# EAGLE design flip_mask (EAGLE 7.7.0)
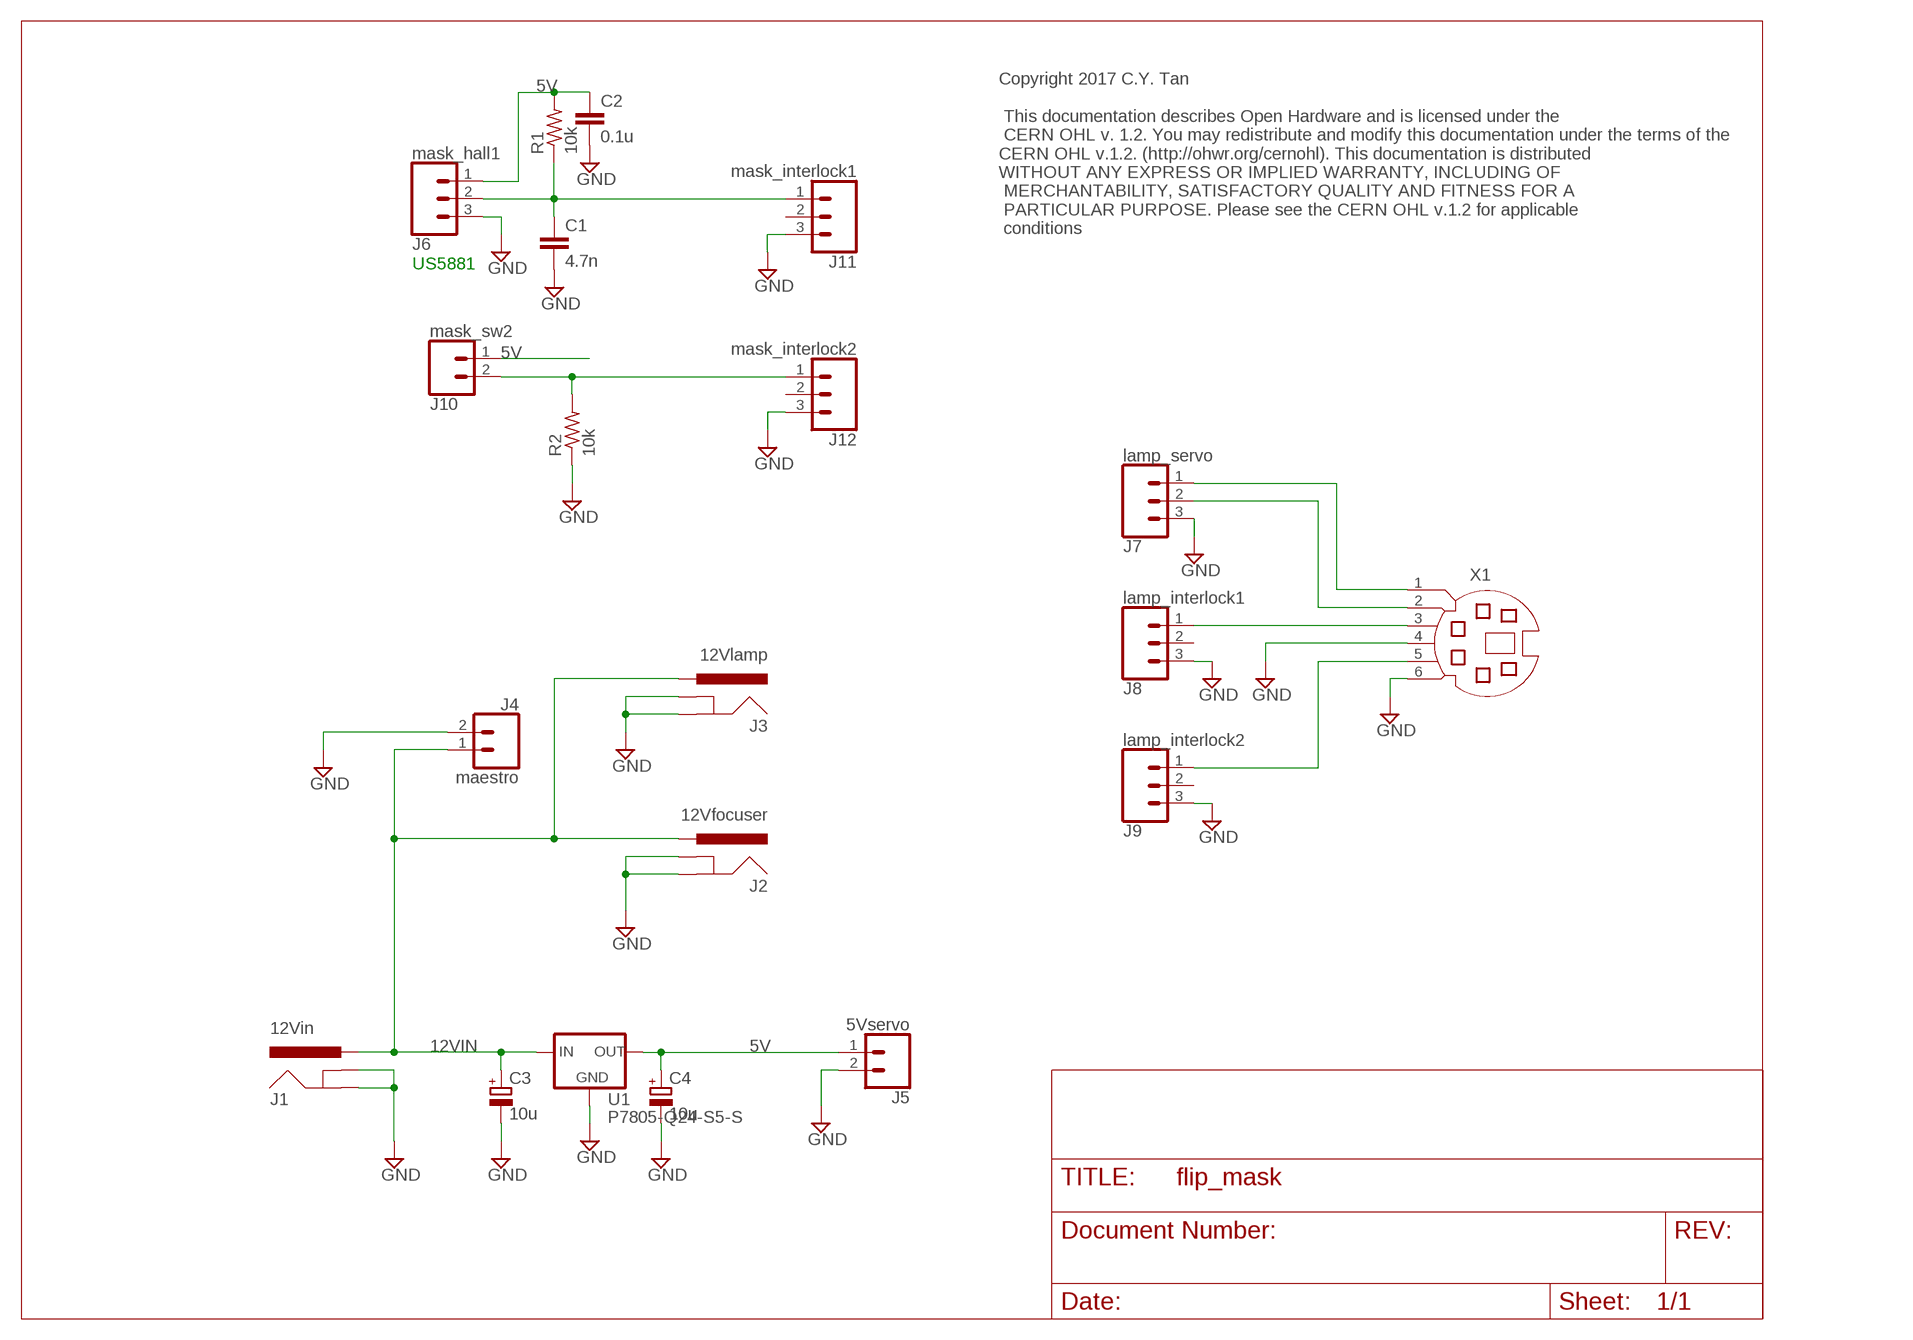
[diagram p0: schematic, sheet 1]

## Parts
C1  4.7n  CAPPTH1  [CAP-PTH-5MM]
C2  0.1u  CAPPTH1  [CAP-PTH-5MM]
C3  10u  CPOL-EUE2.5-6  [E2,5-6]
C4  10u  CPOL-EUE2.5-6  [E2,5-6]
J1  12Vin  POWER_JACK  [POWER_JACK_PTH]
J2  12Vfocuser  POWER_JACK  [POWER_JACK_PTH]
J3  12Vlamp  POWER_JACK  [POWER_JACK_PTH]
J4  maestro  CONN_02  [1X02]
J5  5Vservo  CONN_02  [1X02]
J6  mask_hall1  CONN_03  [1X03]
J7  lamp_servo  CONN_03  [1X03]
J8  lamp_interlock1  CONN_03  [1X03]
J9  lamp_interlock2  CONN_03  [1X03]
J10  mask_sw2  CONN_02  [1X02]
J11  mask_interlock1  CONN_03  [1X03]
J12  mask_interlock2  CONN_03  [1X03]
R1  10k  R-US_0207/10  [0207/10]
R2  10k  R-US_0207/10  [0207/10]
U1  P7805-Q24-S5-S  R-78E5.0-1.0  [DC-DC_CONVERTER_78XX]
X1  MD06SS  [MDIN06SS]

## Nets
5V: C2.1 C4.+ J5.1 J6.1 J10.1 R1.2 U1.VOUT(OUT)
12VIN: C3.+ J1.PWR J2.PWR J3.PWR J4.1 U1.VIN(IN)
GND: C1.2 C2.2 C3.- C4.- J1.GND J1.GNDBREAK J2.GND J2.GNDBREAK J3.GND J3.GNDBREAK J4.2 J5.2 J6.3 J7.3 J8.3 J9.3 J11.3 J12.3 R2.1 U1.GND X1.4 X1.6
N$1: C1.1 J6.2 J11.1 R1.1
N$2: J7.2 X1.2
N$3: J8.1 X1.3
N$4: J10.2 J12.1 R2.2
N$5: J7.1 X1.1
N$6: J9.1 X1.5
Unconnected: J8.2 J9.2 J11.2 J12.2

## Notes on the sheet
- Copyright 2017 C.Y. Tan
  
   This documentation describes Open Hardware and is licensed under the
   CERN OHL v. 1.2. You may redistribute and modify this documentation under the terms of the 
  CERN OHL v.1.2. (http://ohwr.org/cernohl). This documentation is distributed 
  WITHOUT ANY EXPRESS OR IMPLIED WARRANTY, INCLUDING OF
   MERCHANTABILITY, SATISFACTORY QUALITY AND FITNESS FOR A
   PARTICULAR PURPOSE. Please see the CERN OHL v.1.2 for applicable
   conditions
- US5881

## Library data of the parts
C1 C2 = SparkFun-Capacitors:CAP: Capacitor Standard 0603 ceramic capacitor, and 0.1" leaded capacitor.
C3 C4 = resistor:CPOL-EU: POLARIZED CAPACITOR, European symbol
J1-J3 = SparkFun-Connectors:POWER_JACK: Power Jack Connector This is the standard 5.5mm barrel jack for power. The PTH is the most common, proven, reliable, footprint. The Slot footprint only works if the mill layer is transmitted to the PCB fab house so be warned. Here are the connectors we sell at SparkFun: DC Barrel Power Jack/Connector <https://www.sparkfun.com/products/119> (PRT-00119) DC Barrel Power Jack/Connector (SMD) <https://www.sparkfun.com/products/12748> (PRT-12748) DC Barrel Jack Adapter - Breadboard Compatible <https://www.sparkfun.com/products/10811> (PRT-10811) It is used on this SparkFun product (and many, many others): SparkFun RedBoard - Programmed with Arduino <https://www.sparkfun.com/products/12757> (DEV-12757) Also, if you need a mating power supply or connector, please check these out: Wall Adapter Power Supply - 9VDC 650mA <https://www.sparkfun.com/products/298> (TOL-00298) DC Barrel Jack Adapter - Male <https://www.sparkfun.com/products/10287> (PRT-10287); PROD_ID: CONN-08197
J4 J5 J10 = SparkFun-Connectors:CONN_02: Multi connection point. Often used as Generic Header-pin footprint for 0.1 inch spaced/style header connections On any of the 0.1 inch spaced packages, you can populate with these: Break Away Headers - Straight <https://www.sparkfun.com/products/116> (PRT-00116) Break Away Male Headers - Right Angle <https://www.sparkfun.com/products/553> (PRT-00553) Female Headers <https://www.sparkfun.com/products/115> (PRT-00115) Break Away Headers - Machine Pin <https://www.sparkfun.com/products/117> (PRT-00117) Break Away Female Headers - Swiss Machine Pin <https://www.sparkfun.com/products/743> (PRT-00743) For SCREWTERMINALS and SPRING TERMINALS visit here: Screw Terimnals on SparkFun.com <https://www.sparkfun.com/search/results?term=Screw+Terminals> (5mm/3.5mm/2.54mm spacing) This device is also useful as a general connection point to wire up your design to another part of your project. Our various solder wires solder well into these plated through hole pads. Hook-Up Wire - Assortment (Stranded, 22 AWG) <https://www.sparkfun.com/products/11375> (PRT-11375) Hook-Up Wire - Assortment (Solid Core, 22 AWG) <https://www.sparkfun.com/products/11367> (PRT-11367) View the entire wire category on our website here <https://www.sparkfun.com/categories/141> Special notes: Molex polarized connector foot print use with: PRT-08233 with associated crimp pins and housings. 2.54_SCREWTERM for use with PRT-10571. 3.5mm Screw Terminal footprints for PRT-08084 5mm Screw Terminal footprints for use with PRT-08432
J6-J9 J11 J12 = SparkFun-Connectors:CONN_03: Multi connection point. Often used as Generic Header-pin footprint for 0.1 inch spaced/style header connections On any of the 0.1 inch spaced packages, you can populate with these: Break Away Headers - Straight <https://www.sparkfun.com/products/116> (PRT-00116) Break Away Male Headers - Right Angle <https://www.sparkfun.com/products/553> (PRT-00553) Female Headers <https://www.sparkfun.com/products/115> (PRT-00115) Break Away Headers - Machine Pin <https://www.sparkfun.com/products/117> (PRT-00117) Break Away Female Headers - Swiss Machine Pin <https://www.sparkfun.com/products/743> (PRT-00743) Stackable Header - 3 Pin (Female, 0.1") <https://www.sparkfun.com/products/13875> (PRT-13875) For SCREWTERMINALS and SPRING TERMINALS visit here: Screw Terimnals on SparkFun.com <https://www.sparkfun.com/search/results?term=Screw+Terminals> (5mm/3.5mm/2.54mm spacing) This device is also useful as a general connection point to wire up your design to another part of your project. Our various solder wires solder well into these plated through hole pads. Hook-Up Wire - Assortment (Stranded, 22 AWG) <https://www.sparkfun.com/products/11375> (PRT-11375) Hook-Up Wire - Assortment (Solid Core, 22 AWG) <https://www.sparkfun.com/products/11367> (PRT-11367) View the entire wire category on our website here <https://www.sparkfun.com/categories/141> Special notes: Molex polarized connector foot print use with SKU : PRT-08232 with associated crimp pins and housings.
R1 R2 = resistor:R-US_: RESISTOR, American symbol
U1 = SparkFun-IC-Power:R-78E5.0-1.0: Recom Power 5V 1A DC/DC Converter The Recom R-78E5.0-X.X is a compact DC/DC converter module that is a pin for pin drop-in replacement for the LM7805 linear voltage regulator. Specifications: Input Range: 7-28V Output Voltage: 5V Output Current: 1A Max Efficiency: 91% Datasheet <https://www.recom-power.com/pdf/Innoline/R-78Exx-1.0.pdf>; PROD_ID: COM-13655
X1 = con-yamaichi:MD06SS: YAMAICHI CONNECTOR; OC_FARNELL: unknown; OC_NEWARK: unknown

## Board
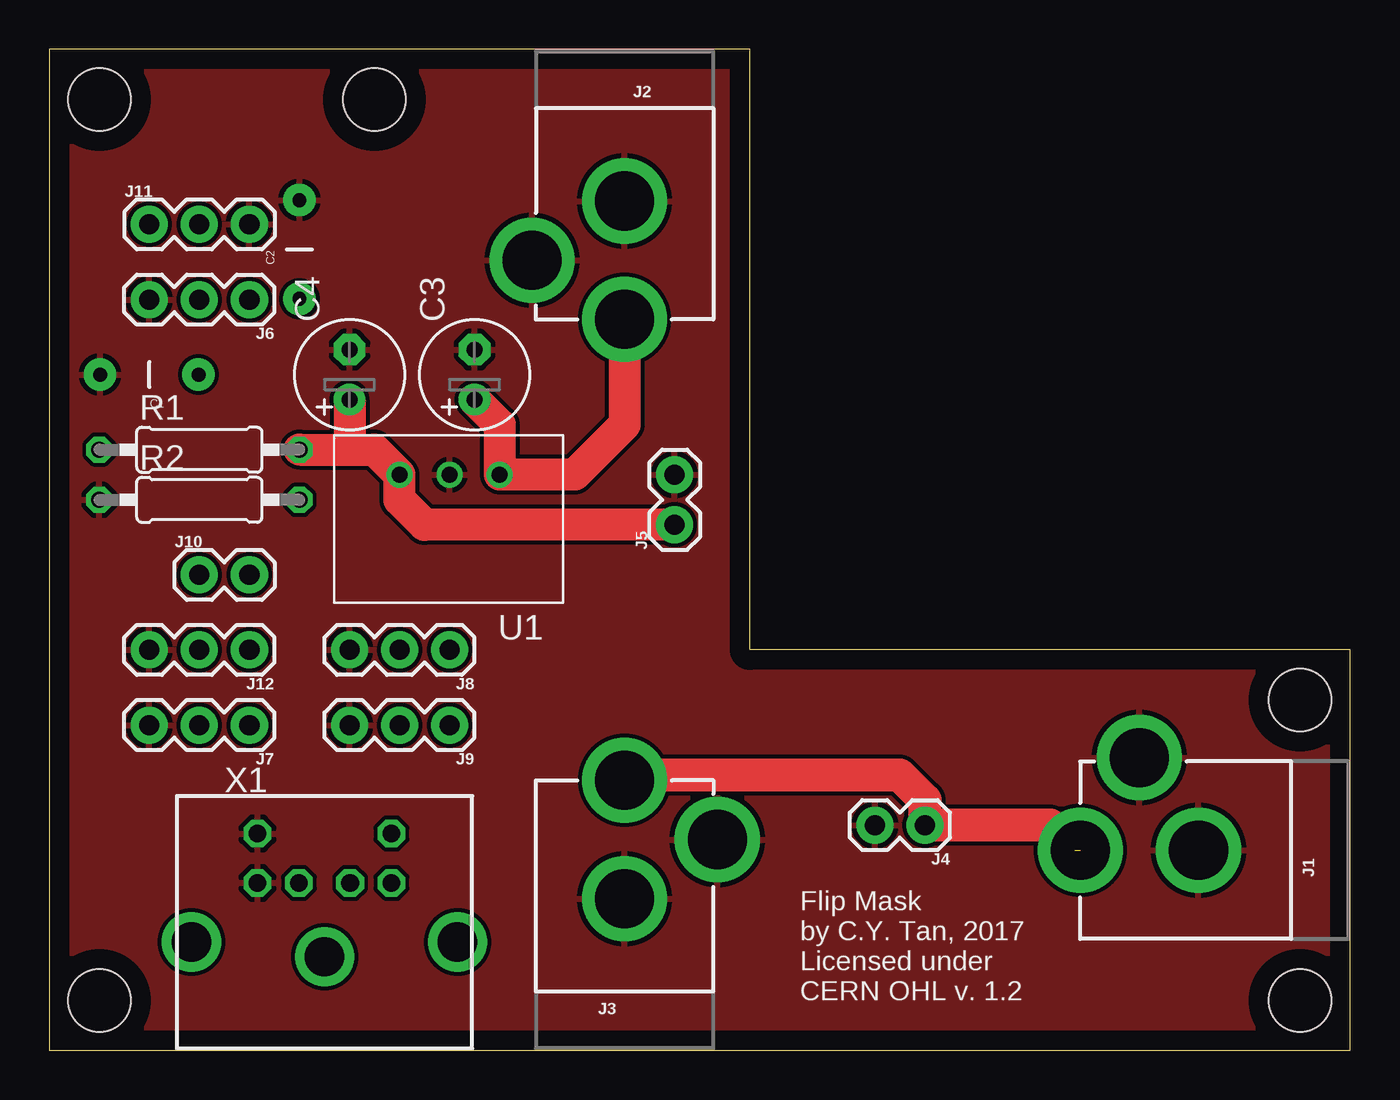
[diagram p1: board, top side]
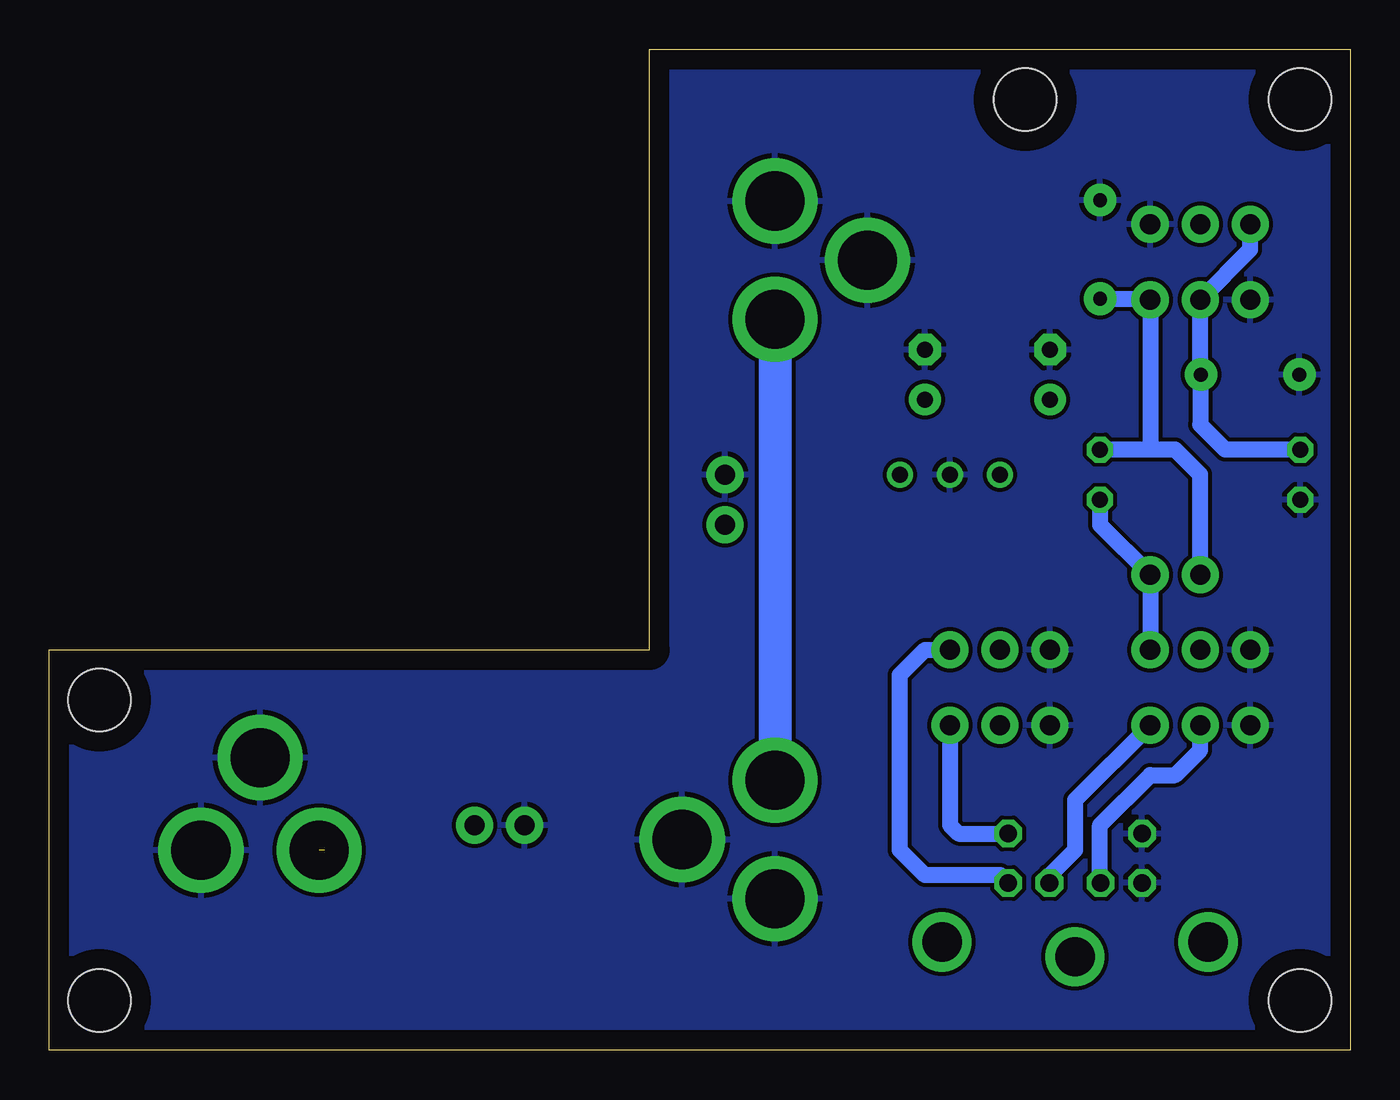
[diagram p2: board, bottom side, seen from below]

Size 66.04 x 50.8 mm. Coordinates in mm from the lower left corner, seen from the top.
Outline: 0,0 66.04,0 66.04,20.32 35.56,20.32 35.56,50.8 0,50.8 0,0
Copper layers (1*16): Top 0.035mm / dielectric 1.5mm / Bottom 0.035mm
Design rules "default": minimum track width 10mil, minimum drill 24mil, track to track 8mil, track to pad 8mil, pad to pad 8mil, via to via 8mil, smd to smd 8mil, copper to edge 40mil, drill to drill 8mil, minimum pad ring 10mil, minimum via ring 8mil, stop-mask expansion 4mil, vias tented up to drill 0mil, thermal gap 10mil
Holes 3.17 mm at 16.51,48.26 2.54,2.54 63.5,2.54 63.5,17.78 2.54,48.26

### Footprints (pad centres in the part's own frame; a part is rotated, then mirrored left to right if it is on the bottom)
CAP-PTH-5MM = drill 0.7 pad 1.651: 1 -2.5,0; 2 2.5,0
E2,5-6 = drill 0.813 pad 1.6: + -1.27,0 | drill 0.813 pad 1.6 octagon: - 1.27,0
POWER_JACK_PTH = drill 2.997 pad 4.318: GND 0,7.7; GNDBREAK 4.7,10.7; PWR 0,13.7
1X02 = drill 1.016 pad 1.88: 1 0,0; 2 2.54,0
1X03 = drill 1.016 pad 1.88: 1 0,0; 2 2.54,0; 3 5.08,0
0207/10 = drill 0.813 octagon: 1 -5.08,0; 2 5.08,0
DC-DC_CONVERTER_78XX = drill 0.8: GND 0,0; VIN -2.54,0; VOUT 2.54,0
MDIN06SS = drill 0.9 octagon: 1 1.3,8.5; 2 -1.3,8.5; 3 3.4,8.5; 4 -3.4,8.5; 5 3.4,11; 6 -3.4,11 | drill 2: P$1 -6.75,5.5; P$2 0,4.75; P$3 6.75,5.5

### Placement (x,y rotation side)
C1  5.08,34.29 180 top
C2  12.7,40.64 90 top
C3  21.59,34.29 90 top
C4  15.24,34.29 90 top
J1  66.04,10.16 90 top
J2  29.21,50.8 180 top
J3  29.21,0 0 top
J4  44.45,11.43 180 top
J5  31.75,26.67 90 top
J6  10.16,38.1 180 top
J7  10.16,16.51 180 top
J8  20.32,20.32 180 top
J9  20.32,16.51 180 top
J10  7.62,24.13 0 top
J11  5.08,41.91 0 top
J12  10.16,20.32 180 top
R1  7.62,30.48 0 top
R2  7.62,27.94 0 top
U1  20.32,29.21 180 top
X1  13.97,0 0 top

### Tracks (layer width: path | path; a pad name or v marks a point on that pad's centre or on a via)
5V
  Top 1.626: J5.1 19.05,26.67 17.78,27.94 U1.VOUT 16.51,30.48 15.24,30.48 | R1.2 15.24,30.48 | C4.+ 15.24,30.48
  Bottom 0.813: J10.1 7.62,29.21 8.89,30.48 10.16,30.48 | 10.16,30.48 R1.2 | 10.16,30.48 J6.1 10.16,38.14 C2.1
12VIN  (1 unrouted)
  Top 1.626: J2.PWR 29.21,31.75 26.67,29.21 U1.VIN 22.86,31.75 C3.+
  Top 1.676: 52.07,10.16 50.8,11.43 J4.1 44.45,12.7 43.18,13.97 29.21,13.97 J3.PWR
  Bottom 1.676: J2.PWR J3.PWR
GND
  pour Top: 0,50.8 0,0 66.04,0 66.04,20.32 35.56,20.32 35.56,50.8
  pour Bottom: 0,50.8 0,0 67.31,0 67.31,19.05 66.04,20.32 35.56,20.32 35.56,50.8
N$1
  Bottom 0.813: R1.1 6.35,30.48 7.62,31.75 7.58,31.79 C1.1 7.62,34.33 J6.2 5.08,40.64 J11.1
N$2
  Bottom 0.813: X1.2 12.7,8.53 12.7,11.43 10.16,13.97 8.89,13.97 7.62,15.24 J7.2
N$3
  Bottom 0.813: X1.3 17.76,8.89 21.59,8.89 22.86,10.16 22.86,19.05 21.59,20.32 J8.1
N$4
  Bottom 0.813: R2.2 12.7,26.67 J10.2 J12.1
N$5
  Bottom 0.813: J7.1 13.97,12.7 13.97,10.16 15.27,8.86 X1.1
N$6
  Bottom 0.813: J9.1 20.32,11.43 19.89,11 X1.5

### Text on the board
tPlace: Flip Mask / by C.Y. Tan, 2017 / Licensed under / CERN OHL v. 1.2